# Altium schematic sheet 1030220084.schdoc
size A4
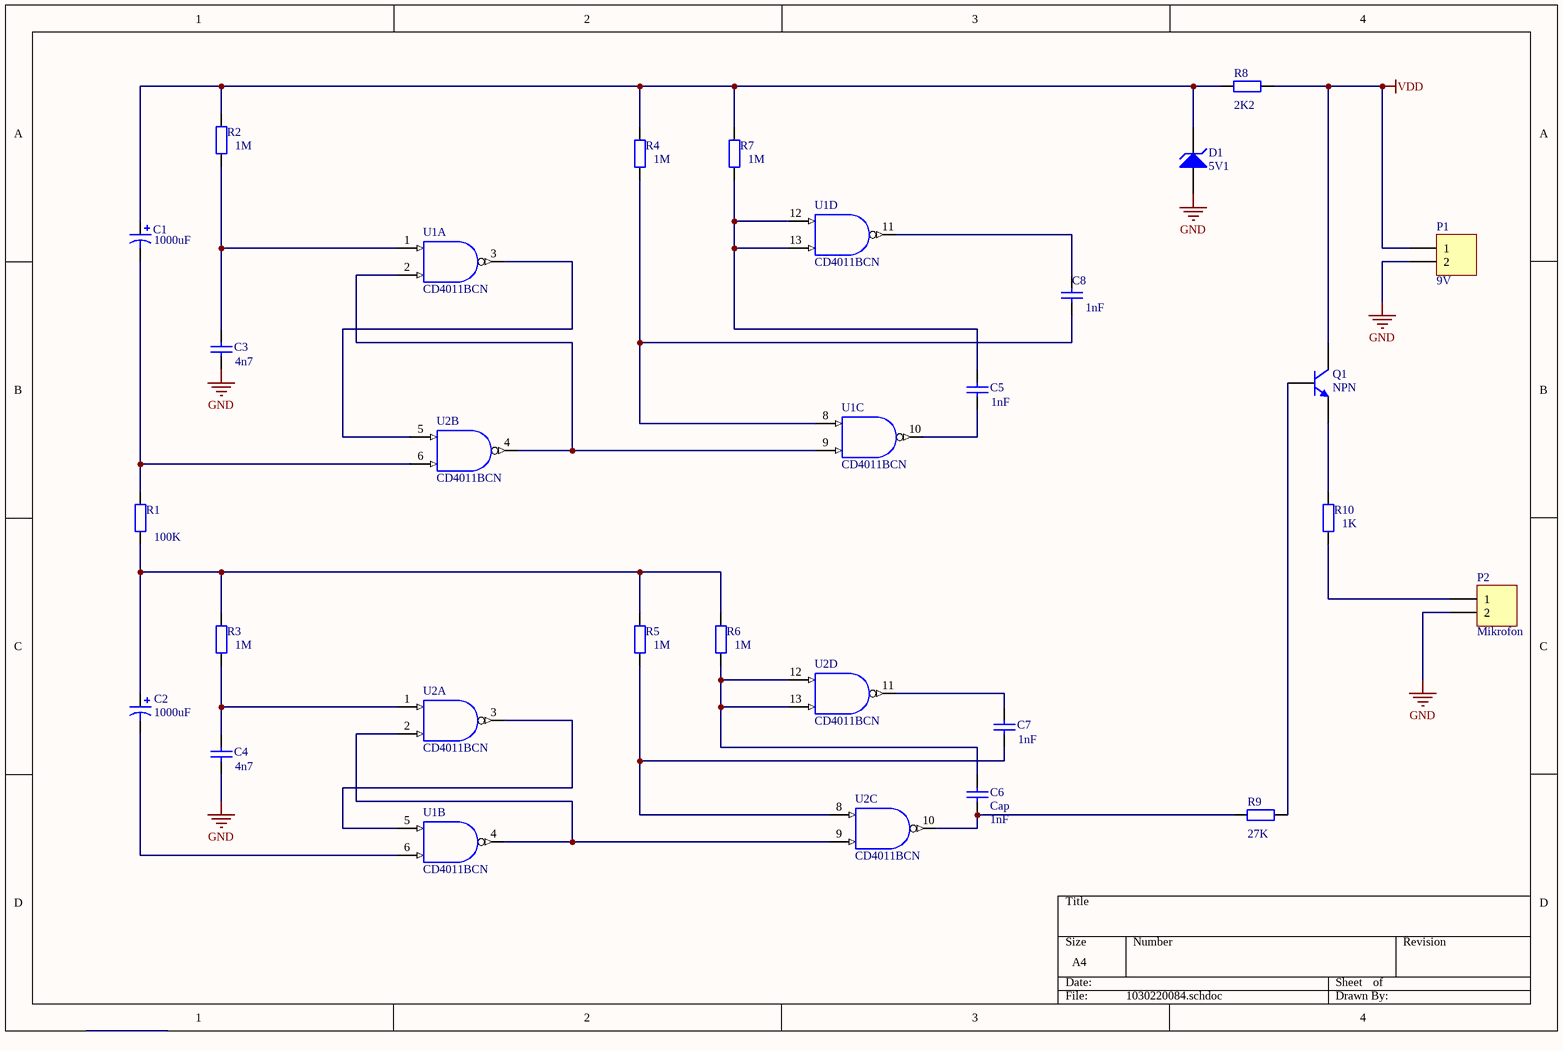
[diagram p0: 1030220084.schdoc]

## Parts
C1  value 1000uF  [RB7.6-15]
C2  value 1000uF  [RB7.6-15]
C3  value 4n7  [RAD-0.3]
C4  value 4n7  [RAD-0.3]
C5  value 1nF  [RAD-0.3]
C6  Cap  value 1nF  [RAD-0.3]
C7  value 1nF  [RAD-0.3]
C8  value 1nF  [RAD-0.3]
D1  5V1  [DIODE-0.7]
P1  9V  [HDR1X2]
P2  Mikrofon  [HDR1X2]
Q1  NPN  [TO-226-AA]
R1  value 100K  [AXIAL-0.4]
R2  value 1M  [AXIAL-0.4]
R3  value 1M  [AXIAL-0.4]
R4  value 1M  [AXIAL-0.4]
R5  value 1M  [AXIAL-0.4]
R6  value 1M  [AXIAL-0.4]
R7  value 1M  [AXIAL-0.4]
R8  value 2K2  [AXIAL-0.4]
R9  value 27K  [AXIAL-0.4]
R10  value 1K  [AXIAL-0.4]
U1  CD4011BCN  [N14A]  (parts A,B,C,D of 4)
U2  CD4011BCN  [N14A]  (parts A,B,C,D of 4)

## Nets
GND: C3.2 C4.1 D1.1(A) P1.2 P2.2 U1.7(GND) U2.7(GND)
VDD: P1.1 Q1.1(C) R8.2 U1.14(VDD) U2.14(VDD)
NetC1_1: C1.1 D1.2(K) R2.2 R4.2 R7.2 R8.1
NetC1_2: C1.2 R1.2 U2.6(B)
NetC2_1: C2.1 R1.1 R3.2 R5.2 R6.2
NetC2_2: C2.2 U1.6(B)
NetC3_1: C3.1 R2.1 U1.1(A)
NetC4_2: C4.2 R3.1 U2.1(A)
NetC5_1: C5.1 U1.10(J)
NetC5_2: C5.2 R7.1 U1.12(A) U1.13(B)
NetC6_1: C6.1 R9.1 U2.10(J)
NetC6_2: C6.2 R6.1 U2.12(A) U2.13(B)
NetC7_1: C7.1 R5.1 U2.8(A)
NetC7_2: C7.2 U2.11(J)
NetC8_1: C8.1 R4.1 U1.8(A)
NetC8_2: C8.2 U1.11(J)
NetP2_1: P2.1 R10.1
NetQ1_2: Q1.2(B) R9.2
NetQ1_3: Q1.3(E) R10.2
NetU1_2: U1.2(B) U1.9(F) U2.4(J)
NetU1_3: U1.3(J) U2.5(A)
NetU1_4: U1.4(J) U2.2(B) U2.9(F)
NetU1_5: U1.5(A) U2.3(J)

## Library data of the parts
C1 C2 = Cap Pol1: Polarized Capacitor (Radial); Published: 8-Jun-2000; LatestRevisionDate: 17-Jul-2002; LatestRevisionNote: Re-released for DXP Platform.; PackageReference: RB7.6-15; Publisher: Altium Limited; PackageDescription: Polarized Capacitor (Radial); 2 Leads
C3-C8 = Cap: Capacitor; Published: 8-Jun-2000; LatestRevisionDate: 17-Jul-2002; LatestRevisionNote: Re-released for DXP Platform.; PackageReference: RAD-0.3; Publisher: Altium Limited; PackageDescription: Radial Cap, Thru-Hole; 2 Leads; 0.3 in Pin Spacing
D1 = D Zener: Zener Diode; Published: 8-Jun-2000; LatestRevisionDate: 17-Jul-2002; LatestRevisionNote: Re-released for DXP Platform.; PackageReference: DIODE-0.7; Publisher: Altium Limited; PackageDescription: Diode, Thru-Hole; 2 Leads; 0.7 in Pin Spacing
P1 = Header 2: LatestRevisionDate: 17-Jul-2002; LatestRevisionNote: Re-released for DXP Platform.; Publisher: Altium Limited
P2 = Header 2: Header, 2-Pin; LatestRevisionDate: 17-Jul-2002; LatestRevisionNote: Re-released for DXP Platform.; Publisher: Altium Limited
Q1 = NPN: NPN Bipolar Transistor; Published: 8-Jun-2000; LatestRevisionDate: 17-Jul-2002; LatestRevisionNote: Re-released for DXP Platform.; PackageReference: TO-226-AA; Publisher: Altium Limited; PackageDescription: TO, Flat Index; 3 In-Line, Axial Leads; Body Dia. 4.8mm; Leads 0.55 x 0.51 mm (max); Code_JEDEC: TO-226-AA
R1-R8 R10 = Res2: Resistor; Published: 8-Jun-2000; LatestRevisionDate: 17-Jul-2002; LatestRevisionNote: Re-released for DXP Platform.; PackageReference: AXIAL-0.4; Publisher: Altium Limited; PackageDescription: Axial Device, Thru-Hole; 2 Leads; 0.4 in Pin Spacing
R9 = Res2: resistor; Published: 8-Jun-2000; LatestRevisionDate: 17-Jul-2002; LatestRevisionNote: Re-released for DXP Platform.; PackageReference: AXIAL-0.4; Publisher: Altium Limited; PackageDescription: Axial Device, Thru-Hole; 2 Leads; 0.4 in Pin Spacing
U1 U2 = CD4011BCN: Quad 2-Input NAND Buffered B series Gate, 14-Pin PDIP; IC_Technology: C; Published: 17-Jul-2002; LatestRevisionDate: 29-May-2009; LatestRevisionNote: Component Body Added.; DatasheetVersion: Jan-1999; PackageVersion: 2000; PackageReference: N14A; Publisher: Altium Limited; PackageDescription: DIP, 14-Pin, Row Spacing 7.62 mm, Pitch 2.54 mm; ComponentLink1Description: Manufacturer Link; ComponentLink1URL: http://www.fairchildsemi.com/; ComponentLink2Description: Datasheet; ComponentLink2URL: http://www.fairchildsemi.com/ds/CD%2FCD4001BC.pdf